# EasyEDA Pro project 4runner tachometer board.eprj

# Schematic Schematic1
Board Name: Board1; Create Date: 2026-04-29; Page Name: P1; Project Name: 4runner tachometer board; Schematic Name: Schematic1; Update Date: 2026-04-29; Company: EasyEDA.com; Page Size: A4; Version: V1.0
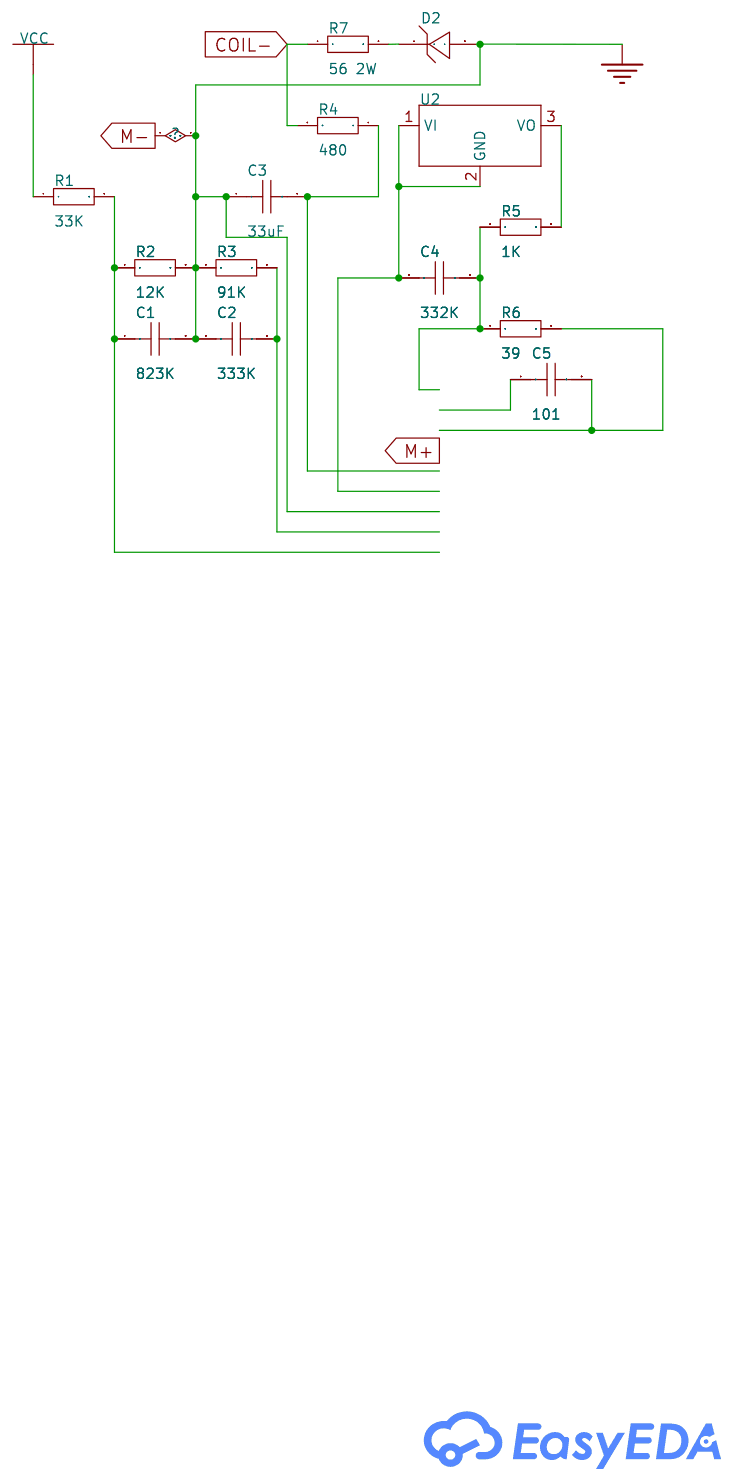
[diagram p0: schematic sheet]

## Parts
C1  823K  [C0603]
C2  333K  [C0603]
C3  33uF  [C0603]
C4  332K  [C0603]
C5  101  [C0603]
D2  -  [SOD-123_L2.7-W1.6-LS3.7-RD]
R1  33K  [R0603]
R2  12K  [R0603]
R3  91K  [R0603]
R4  480  [R0603]
R5  1K  [R0603]
R6  39  [R0603]
R7  56 2W  [R0603]
U2  -  [TO-220F-3_L10.2-W4.7-P2.54-L]

## Library data of the parts
C1-C5 = CAP_0603: Supplier Footprint: 0603
D2 = MMSZ5226BT1G: LCSC Part Name: 3.3V ±5% 500mW; Supplier Part: C235771; Manufacturer: onsemi(安森美); Supplier Footprint: SOD-123; JLCPCB Part Class: Extended Part; Datasheet: https://atta.szlcsc.com/upload/public/pdf/source/20180629/C235771_FF45FF3C3F05A20E00589F2D6358FE71.PDF; Supplier: LCSC; Diode Configuration: Single; Zener Voltage (Nom): 3.3V; Zener Voltage (Range): 3.14V~3.47V; Tolerance: ±5%; Power Dissipation: 500mW; Reverse Leakage Current (Ir): 25μA@1V; Zener Impedance (Zzt): 28Ω
R1-R7 = Res_0603: Supplier Footprint: 0603
U2 = KIA7805API-U/PF: LCSC Part Name: Vin=35V Vout=5V 1A; Supplier Part: C69761; Manufacturer: KEC; Supplier Footprint: TO-220F(TO-220IS); JLCPCB Part Class: Extended Part; Datasheet: https://atta.szlcsc.com/upload/public/pdf/source/20170814/C69761_1502678427921886009.pdf; Supplier: LCSC; Output Polarity: Positive; Number of Outputs: 1; Maximum Input Voltage: 35V; Output Voltage: 5V~5V; Dropout Voltage: 2V@(1A); Output Current: 1A

## Nets
GND: C1.2 C2.1 C3.1 R2.2 R3.1
VCC: R1.1
COIL-: R4.2 R7.1
Net-(C1-1): C1.1 R1.2 R2.1
Net-(C2-2): C2.2 R3.2
Net-(C3-2): C3.2 R4.1
Net-(C4-1): C4.1 U2.1(VI) U2.2(GND)
Net-(C4-2): C4.2 R5.1 R6.1
Net-(C5-2): C5.2 R6.2
Net-(R5-2): R5.2 U2.3(VO)

Not connected (* = marked no-connect by the designer): C5 1; D2 1(K) 2(A); R7 2
